# Altium schematic sheet 12-LedMatrix(74138+74595).SchDoc
size A4
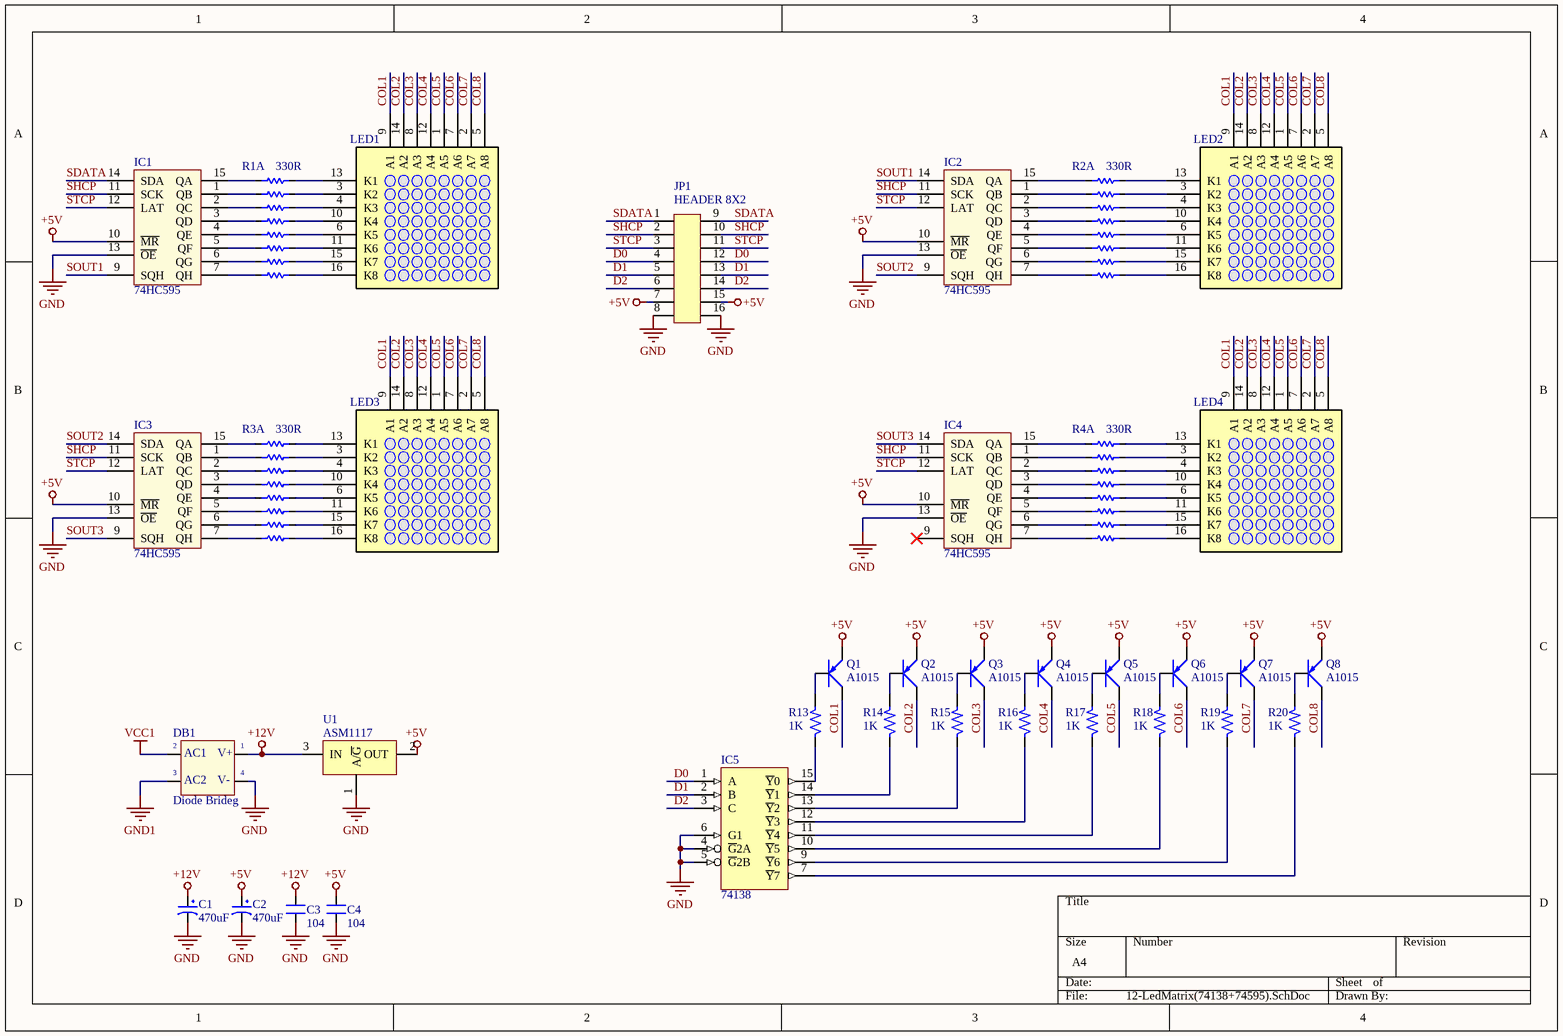
[diagram p0: 12-LedMatrix(74138+74595).SchDoc]

## Parts
C1  470uF  [C-ALU-D6.5]
C2  470uF  [C-ALU-D6.5]
C3  104  [C-0805]
C4  104  [C-0805]
DB1  Diode Brideg  [D-DB-1A-SMD]
IC1  74HC595  [SOIC-16]
IC2  74HC595  [SOIC-16]
IC3  74HC595  [SOIC-16]
IC4  74HC595  [SOIC-16]
IC5  74138  [SOIC-16]
JP1  HEADER 8X2  [JP8X2]
LED1  8x8S  [Matrix8x8-2x2mm]  (value not drawn)
LED2  8x8S  [Matrix8x8-2x2mm]  (value not drawn)
LED3  8x8S  [Matrix8x8-2x2mm]  (value not drawn)
LED4  8x8S  [Matrix8x8-2x2mm]  (value not drawn)
Q1  A1015  [SOT-23-3]
Q2  A1015  [SOT-23-3]
Q3  A1015  [SOT-23-3]
Q4  A1015  [SOT-23-3]
Q5  A1015  [SOT-23-3]
Q6  A1015  [SOT-23-3]
Q7  A1015  [SOT-23-3]
Q8  A1015  [SOT-23-3]
R1  330R  [R-Array-0603-4]  (parts A,B,C,D of 4)
R2  330R  [R-Array-0603-4]  (parts A,B,C,D of 4)
R3  330R  [R-Array-0603-4]  (parts A,B,C,D of 4)
R4  330R  [R-Array-0603-4]  (parts A,B,C,D of 4)
R5  330R  [R-Array-0603-4]  (value not drawn)  (parts B,C of 4)
R6  330R  [R-Array-0603-4]  (value not drawn)  (parts B,C of 4)
R7  330R  [R-Array-0603-4]  (value not drawn)  (parts B,C of 4)
R8  330R  [R-Array-0603-4]  (value not drawn)  (parts B,C of 4)
R9  330R  [R-Array-0603-4]  (value not drawn)  (parts B,C of 4)
R10  330R  [R-Array-0603-4]  (value not drawn)  (parts B,C of 4)
R11  330R  [R-Array-0603-4]  (value not drawn)  (parts B,C of 4)
R12  330R  [R-Array-0603-4]  (value not drawn)  (parts B,C of 4)
R13  1K  [R-0805]
R14  1K  [R-0805]
R15  1K  [R-0805]
R16  1K  [R-0805]
R17  1K  [R-0805]
R18  1K  [R-0805]
R19  1K  [R-0805]
R20  1K  [R-0805]
U1  ASM1117  [TO-252]

## Nets
+5V: C2.1 C4.2 IC1.10(~{MR}) IC1.16(VCC) IC2.10(~{MR}) IC2.16(VCC) IC3.10(~{MR}) IC3.16(VCC) IC4.10(~{MR}) IC4.16(VCC) IC5.16(VCC) JP1.7 JP1.15 Q1.1(E) Q2.1(E) Q3.1(E) Q4.1(E) Q5.1(E) Q6.1(E) Q7.1(E) Q8.1(E) U1.2(OUT)
+12V: C1.1 C3.2 DB1.3(AC2) U1.3(IN)
GND: C1.2 C2.2 C3.1 C4.1 DB1.4(-V_OUT) IC1.8(GND) IC1.13(~{OE}) IC2.8(GND) IC2.13(~{OE}) IC3.8(GND) IC3.13(~{OE}) IC4.8(GND) IC4.13(~{OE}) IC5.4(~{G}2A) IC5.5(~{G}2B) IC5.6(G1) IC5.8(GND) JP1.8 JP1.16 U1.1(A/~{G})
GND1: DB1.1(+V_OUT)
VCC1: DB1.2(AC1)
COL1: LED1.9(A1) LED2.9(A1) LED3.9(A1) LED4.9(A1) Q1.2(C)
COL2: LED1.14(A2) LED2.14(A2) LED3.14(A2) LED4.14(A2) Q2.2(C)
COL3: LED1.8(A3) LED2.8(A3) LED3.8(A3) LED4.8(A3) Q3.2(C)
COL4: LED1.12(A4) LED2.12(A4) LED3.12(A4) LED4.12(A4) Q4.2(C)
COL5: LED1.1(A5) LED2.1(A5) LED3.1(A5) LED4.1(A5) Q5.2(C)
COL6: LED1.7(A6) LED2.7(A6) LED3.7(A6) LED4.7(A6) Q6.2(C)
COL7: LED1.2(A7) LED2.2(A7) LED3.2(A7) LED4.2(A7) Q7.2(C)
COL8: LED1.5(A8) LED2.5(A8) LED3.5(A8) LED4.5(A8) Q8.2(C)
D0: IC5.1(A) JP1.4 JP1.12
D1: IC5.2(B) JP1.5 JP1.13
D2: IC5.3(C) JP1.6 JP1.14
SDATA: IC1.14(SDA) JP1.1 JP1.9
SHCP: IC1.11(SCK) IC2.11(SCK) IC3.11(SCK) IC4.11(SCK) JP1.2 JP1.10
SOUT1: IC1.9(SQH) IC2.14(SDA)
SOUT2: IC2.9(SQH) IC3.14(SDA)
SOUT3: IC3.9(SQH) IC4.14(SDA)
STCP: IC1.12(LAT) IC2.12(LAT) IC3.12(LAT) IC4.12(LAT) JP1.3 JP1.11
NetIC1_1: IC1.1(QB) R1.3
NetIC1_2: IC1.2(QC) R1.5
NetIC1_3: IC1.3(QD) R3.3
NetIC1_4: IC1.4(QE) R3.5
NetIC1_5: IC1.5(QF) R5.3
NetIC1_6: IC1.6(QG) R5.5
NetIC1_7: IC1.7(QH) R1.7
NetIC1_15: IC1.15(QA) R1.1
NetIC2_1: IC2.1(QB) R2.3
NetIC2_2: IC2.2(QC) R2.5
NetIC2_3: IC2.3(QD) R4.3
NetIC2_4: IC2.4(QE) R4.5
NetIC2_5: IC2.5(QF) R6.3
NetIC2_6: IC2.6(QG) R6.5
NetIC2_7: IC2.7(QH) R2.7
NetIC2_15: IC2.15(QA) R2.1
NetIC3_1: IC3.1(QB) R7.3
NetIC3_2: IC3.2(QC) R7.5
NetIC3_3: IC3.3(QD) R9.3
NetIC3_4: IC3.4(QE) R9.5
NetIC3_5: IC3.5(QF) R11.3
NetIC3_6: IC3.6(QG) R11.5
NetIC3_7: IC3.7(QH) R3.7
NetIC3_15: IC3.15(QA) R3.1
NetIC4_1: IC4.1(QB) R8.3
NetIC4_2: IC4.2(QC) R8.5
NetIC4_3: IC4.3(QD) R10.3
NetIC4_4: IC4.4(QE) R10.5
NetIC4_5: IC4.5(QF) R12.3
NetIC4_6: IC4.6(QG) R12.5
NetIC4_7: IC4.7(QH) R4.7
NetIC4_15: IC4.15(QA) R4.1
NetIC5_7: IC5.7(~{Y}7) R20.1
NetIC5_9: IC5.9(~{Y}6) R19.1
NetIC5_10: IC5.10(~{Y}5) R18.1
NetIC5_11: IC5.11(~{Y}4) R17.1
NetIC5_12: IC5.12(~{Y}3) R16.1
NetIC5_13: IC5.13(~{Y}2) R15.1
NetIC5_14: IC5.14(~{Y}1) R14.1
NetIC5_15: IC5.15(~{Y}0) R13.1
NetLED1_3: LED1.3(K2) R1.4
NetLED1_4: LED1.4(K3) R1.6
NetLED1_6: LED1.6(K5) R3.6
NetLED1_10: LED1.10(K4) R3.4
NetLED1_11: LED1.11(K6) R5.4
NetLED1_13: LED1.13(K1) R1.2
NetLED1_15: LED1.15(K7) R5.6
NetLED1_16: LED1.16(K8) R1.8
NetLED2_3: LED2.3(K2) R2.4
NetLED2_4: LED2.4(K3) R2.6
NetLED2_6: LED2.6(K5) R4.6
NetLED2_10: LED2.10(K4) R4.4
NetLED2_11: LED2.11(K6) R6.4
NetLED2_13: LED2.13(K1) R2.2
NetLED2_15: LED2.15(K7) R6.6
NetLED2_16: LED2.16(K8) R2.8
NetLED3_3: LED3.3(K2) R7.4
NetLED3_4: LED3.4(K3) R7.6
NetLED3_6: LED3.6(K5) R9.6
NetLED3_10: LED3.10(K4) R9.4
NetLED3_11: LED3.11(K6) R11.4
NetLED3_13: LED3.13(K1) R3.2
NetLED3_15: LED3.15(K7) R11.6
NetLED3_16: LED3.16(K8) R3.8
NetLED4_3: LED4.3(K2) R8.4
NetLED4_4: LED4.4(K3) R8.6
NetLED4_6: LED4.6(K5) R10.6
NetLED4_10: LED4.10(K4) R10.4
NetLED4_11: LED4.11(K6) R12.4
NetLED4_13: LED4.13(K1) R4.2
NetLED4_15: LED4.15(K7) R12.6
NetLED4_16: LED4.16(K8) R4.8
NetQ1_3: Q1.3(B) R13.2
NetQ2_3: Q2.3(B) R14.2
NetQ3_3: Q3.3(B) R15.2
NetQ4_3: Q4.3(B) R16.2
NetQ5_3: Q5.3(B) R17.2
NetQ6_3: Q6.3(B) R18.2
NetQ7_3: Q7.3(B) R19.2
NetQ8_3: Q8.3(B) R20.2

Not connected (* = marked no-connect by the designer): IC4 9(SQH)*

## Notes on the sheet
- (in symbol DB) V+; V-

## Library data of the parts
C1 C2 = CP1: Cap P  0,1uF < 22uF , 16 - 50V; Value: 10uF/50V; Description 1: 10 => 220uF/6,3V/10V - 10uF => 100uF/16V; Description 2: 0,1uF => 33uF/50V - 10uF => 22uF/63V; Description 3: 0,47uF => 10uF/100V
C3 C4 = CN: Value: 0,1uF/300V; Designed by: VanDungEvn
DB1 = DB: Convert AC to DC voltage, 4 pin; Value: Cau 1A
IC1-IC4 = 74595: 8 Bit Serial input - Parallel Output; Value: 74HC595
IC5 = 74138: 3 -to- 8 Decoder - Out Low; Value: 74138; Copyright by: VanDungEvn@Gmail.com
JP1 = JP8X2: Value: JP8x2
LED1-LED4 = LED-8x8S
Q1-Q8 = A1015: PNP 600mW, ECB; Value: A1015
R1-R12 = Res Array 4: RES ARRAY 4 RES 330 OHM 1206; Manufacturer: Panasonic Electronic Components; Manufacturer Part Number: EXB-38V331JV; Digi-Key Part Number: Y9331TR-ND; Link: http://www.digikey.com/product-detail/en/EXB-38V331JV/Y9331TR-ND/256525
R13-R20 = R: Resistor 1/4W; Value: R1/4W - 1K